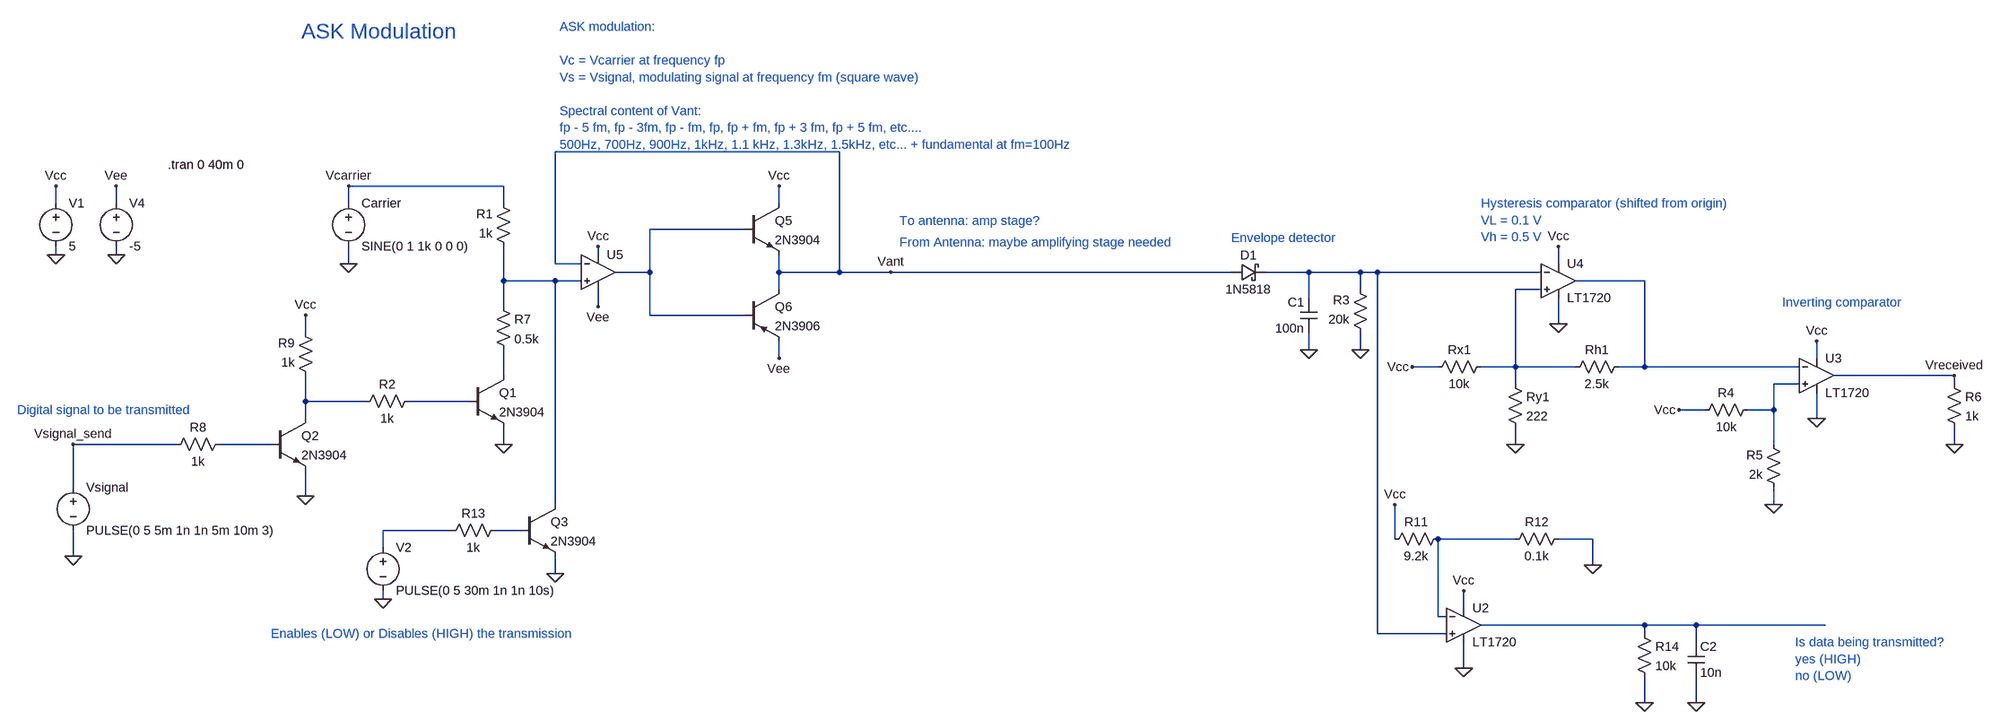
[diagram p0: schematic ASK-modulation3.asc]
ASK-modulation3.asc, the LTspice schematic file:
Version 4
SHEET 1 3624 1304
WIRE 400 -32 -128 -32
WIRE -224 32 -512 32
WIRE -1056 64 -1056 32
WIRE -944 64 -944 32
WIRE -512 64 -512 32
WIRE -224 64 -224 32
WIRE 288 64 288 32
WIRE 224 112 48 112
WIRE -1056 160 -1056 144
WIRE -944 160 -944 144
WIRE -48 160 -48 144
WIRE -512 176 -512 144
WIRE -128 176 -128 -32
WIRE -80 176 -128 176
WIRE 1760 176 1760 144
WIRE 48 192 48 112
WIRE 48 192 -16 192
WIRE 288 192 288 160
WIRE 400 192 400 -32
WIRE 400 192 288 192
WIRE 496 192 400 192
WIRE 1152 192 496 192
WIRE 1296 192 1216 192
WIRE 1392 192 1296 192
WIRE 1424 192 1392 192
WIRE 1728 192 1424 192
WIRE -224 208 -224 144
WIRE -128 208 -224 208
WIRE -80 208 -128 208
WIRE 1920 208 1792 208
WIRE 288 224 288 192
WIRE 1392 224 1392 192
WIRE 1728 224 1680 224
WIRE 1296 240 1296 192
WIRE -224 256 -224 208
WIRE -48 256 -48 224
WIRE 48 272 48 192
WIRE 224 272 48 272
WIRE 1760 288 1760 240
WIRE -592 304 -592 272
WIRE 1296 336 1296 304
WIRE 1392 336 1392 304
WIRE 288 352 288 320
WIRE 2240 352 2240 320
WIRE 1536 368 1488 368
WIRE 1680 368 1680 224
WIRE 1680 368 1616 368
WIRE 1792 368 1680 368
WIRE 1920 368 1920 208
WIRE 1920 368 1872 368
WIRE 2208 368 1920 368
WIRE -224 384 -224 336
WIRE 2496 384 2272 384
WIRE 1680 400 1680 368
WIRE 2208 400 2160 400
WIRE 2496 400 2496 384
WIRE -592 432 -592 384
WIRE -480 432 -592 432
WIRE -288 432 -400 432
WIRE 2032 448 1984 448
WIRE 2160 448 2160 400
WIRE 2160 448 2112 448
WIRE -592 464 -592 432
WIRE 2240 464 2240 416
WIRE -832 512 -1024 512
WIRE -656 512 -752 512
WIRE -224 512 -224 480
WIRE 1680 512 1680 480
WIRE 2160 512 2160 448
WIRE 2496 512 2496 480
WIRE -1024 592 -1024 512
WIRE -592 608 -592 560
WIRE -128 624 -128 208
WIRE 2160 624 2160 592
WIRE -320 672 -448 672
WIRE -192 672 -240 672
WIRE 1456 688 1456 624
WIRE 1680 688 1536 688
WIRE 1824 688 1760 688
WIRE -448 704 -448 672
WIRE -1024 720 -1024 672
WIRE 1824 736 1824 688
WIRE -128 752 -128 720
WIRE -448 800 -448 784
WIRE 1584 816 1584 784
WIRE 1536 832 1536 688
WIRE 1552 832 1536 832
WIRE 1920 848 1616 848
WIRE 2016 848 1920 848
WIRE 2256 848 2016 848
WIRE 1424 864 1424 192
WIRE 1552 864 1424 864
WIRE 1920 864 1920 848
WIRE 2016 880 2016 848
WIRE 1584 928 1584 880
WIRE 1920 992 1920 944
WIRE 2016 992 2016 944
FLAG -1024 720 0
FLAG -512 176 0
FLAG -224 512 0
FLAG -1056 160 0
FLAG -1056 32 Vcc
FLAG -944 160 0
FLAG -944 32 Vee
FLAG 1392 336 0
FLAG 1760 144 Vcc
FLAG 1680 512 0
FLAG 1760 288 0
FLAG 1488 368 Vcc
FLAG 2240 320 Vcc
FLAG 2240 464 0
FLAG 2160 624 0
FLAG 1984 448 Vcc
FLAG 2496 512 0
FLAG -48 144 Vcc
FLAG -48 256 Vee
FLAG 1296 336 0
FLAG 2496 384 Vreceived
FLAG 496 192 Vant
FLAG -592 272 Vcc
FLAG -592 608 0
FLAG -128 752 0
FLAG -1024 512 Vsignal_send
FLAG -512 32 Vcarrier
FLAG 288 352 Vee
FLAG 288 32 Vcc
FLAG -448 800 0
FLAG 1584 784 Vcc
FLAG 1584 928 0
FLAG 1456 624 Vcc
FLAG 1824 736 0
FLAG 1920 992 0
FLAG 2016 992 0
SYMBOL voltage -1056 48 R0
WINDOW 123 0 0 Left 0
WINDOW 39 0 0 Left 0
SYMATTR InstName V1
SYMATTR Value 5
SYMBOL voltage -512 48 R0
WINDOW 123 0 0 Left 0
WINDOW 39 0 0 Left 0
SYMATTR InstName Carrier
SYMATTR Value SINE(0 1 1k 0 0 0)
SYMBOL res -208 160 R180
WINDOW 0 36 76 Left 2
WINDOW 3 36 40 Left 2
SYMATTR InstName R1
SYMATTR Value 1k
SYMBOL npn -288 384 R0
SYMATTR InstName Q1
SYMATTR Value 2N3904
SYMBOL voltage -1024 576 R0
WINDOW 123 0 0 Left 0
WINDOW 39 0 0 Left 0
SYMATTR InstName Vsignal
SYMATTR Value PULSE(0 5 5m 1n 1n 5m 10m 3)
SYMBOL voltage -944 48 R0
WINDOW 123 0 0 Left 0
WINDOW 39 0 0 Left 0
SYMATTR InstName V4
SYMATTR Value -5
SYMBOL res -384 416 R90
WINDOW 0 0 56 VBottom 2
WINDOW 3 32 56 VTop 2
SYMATTR InstName R2
SYMATTR Value 1k
SYMBOL res 1408 320 R180
WINDOW 0 36 76 Left 2
WINDOW 3 36 40 Left 2
SYMATTR InstName R3
SYMATTR Value 20k
SYMBOL cap 1312 304 R180
WINDOW 0 24 56 Left 2
WINDOW 3 24 8 Left 2
SYMATTR InstName C1
SYMATTR Value 100n
SYMBOL res 1632 352 R90
WINDOW 0 0 56 VBottom 2
WINDOW 3 32 56 VTop 2
SYMATTR InstName Rx1
SYMATTR Value 10k
SYMBOL res 1664 384 R0
SYMATTR InstName Ry1
SYMATTR Value 222
SYMBOL res 1888 352 R90
WINDOW 0 0 56 VBottom 2
WINDOW 3 32 56 VTop 2
SYMATTR InstName Rh1
SYMATTR Value 2.5k
SYMBOL Comparators\\LT1720 1760 144 R0
SYMATTR InstName U4
SYMBOL Comparators\\LT1720 2240 320 R0
SYMATTR InstName U3
SYMBOL res 2128 432 R90
WINDOW 0 0 56 VBottom 2
WINDOW 3 32 56 VTop 2
SYMATTR InstName R4
SYMATTR Value 10k
SYMBOL res 2176 608 R180
WINDOW 0 36 76 Left 2
WINDOW 3 36 40 Left 2
SYMATTR InstName R5
SYMATTR Value 2k
SYMBOL res 2480 384 R0
SYMATTR InstName R6
SYMATTR Value 1k
SYMBOL Opamps\\UniversalOpamp2 -48 192 R0
SYMATTR InstName U5
SYMBOL schottky 1152 208 R270
WINDOW 0 32 32 VTop 2
WINDOW 3 0 32 VBottom 2
SYMATTR InstName D1
SYMATTR Value 1N5818
SYMATTR Description Diode
SYMATTR Type diode
SYMBOL res -240 240 R0
SYMATTR InstName R7
SYMATTR Value 0.5k
SYMBOL npn -656 464 R0
SYMATTR InstName Q2
SYMATTR Value 2N3904
SYMBOL res -736 496 R90
WINDOW 0 0 56 VBottom 2
WINDOW 3 32 56 VTop 2
SYMATTR InstName R8
SYMATTR Value 1k
SYMBOL res -576 400 R180
WINDOW 0 36 76 Left 2
WINDOW 3 36 40 Left 2
SYMATTR InstName R9
SYMATTR Value 1k
SYMBOL npn -192 624 R0
SYMATTR InstName Q3
SYMATTR Value 2N3904
SYMBOL res -224 656 R90
WINDOW 0 0 56 VBottom 2
WINDOW 3 32 56 VTop 2
SYMATTR InstName R13
SYMATTR Value 1k
SYMBOL npn 224 64 R0
SYMATTR InstName Q5
SYMATTR Value 2N3904
SYMBOL pnp 224 224 R0
SYMATTR InstName Q6
SYMATTR Value 2N3906
SYMBOL voltage -448 688 R0
WINDOW 123 0 0 Left 0
WINDOW 39 0 0 Left 0
SYMATTR InstName V2
SYMATTR Value PULSE(0 5 30m 1n 1n 10s)
SYMBOL Comparators\\LT1720 1584 784 R0
SYMATTR InstName U2
SYMBOL res 1552 672 R90
WINDOW 0 0 56 VBottom 2
WINDOW 3 32 56 VTop 2
SYMATTR InstName R11
SYMATTR Value 9.2k
SYMBOL res 1776 672 R90
WINDOW 0 0 56 VBottom 2
WINDOW 3 32 56 VTop 2
SYMATTR InstName R12
SYMATTR Value 0.1k
SYMBOL res 1904 848 R0
SYMATTR InstName R14
SYMATTR Value 10k
SYMBOL cap 2000 880 R0
SYMATTR InstName C2
SYMATTR Value 10n
TEXT -600 -256 Left 4 ;ASK Modulation
TEXT -848 -8 Left 2 !.tran 0 40m 0
TEXT 512 96 Left 2 ;To antenna: amp stage?
TEXT -1128 448 Left 2 ;Digital signal to be transmitted
TEXT 512 136 Left 2 ;From Antenna: maybe amplifying stage needed
TEXT 1152 128 Left 2 ;Envelope detector
TEXT 1616 64 Left 2 ;Hysteresis comparator (shifted from origin)\nVL = 0.1 V\nVh = 0.5 V
TEXT 2176 248 Left 2 ;Inverting comparator
TEXT -120 -264 Left 2 ;ASK modulation:\n \nVc = Vcarrier at frequency fp\nVs = Vsignal, modulating signal at frequency fm (square wave)\n \nSpectral content of Vant:\nfp - 5 fm, fp - 3fm, fp - fm, fp, fp + fm, fp + 3 fm, fp + 5 fm, etc....\n500Hz, 700Hz, 900Hz, 1kHz, 1.1 kHz, 1.3kHz, 1.5kHz, etc... + fundamental at fm=100Hz
TEXT -656 864 Left 2 ;Enables (LOW) or Disables (HIGH) the transmission
TEXT 2200 880 Left 2 ;Is data being transmitted?\nyes (HIGH)\nno (LOW)

The netlist it stands for:
* ASK-modulation3.asc
V1 Vcc 0 5
V§Carrier Vcarrier 0 SINE(0 1 1k 0 0 0)
R1 N003 Vcarrier 1k
Q1 N006 N009 0 0 2N3904
Vsignal Vsignal_send 0 PULSE(0 5 5m 1n 1n 5m 10m 3)
V4 Vee 0 -5
R2 N009 N008 1k
R3 0 N002 20k
C1 0 N002 100n
Rx1 N005 Vcc 10k
Ry1 N005 0 222
Rh1 N004 N005 2.5k
XU4 N005 N002 Vcc 0 N004 LT1720  ; pins In+ In- V+ V- OUT
XU3 N007 N004 Vcc 0 Vreceived LT1720  ; pins In+ In- V+ V- OUT
R4 N007 Vcc 10k
R5 0 N007 2k
R6 Vreceived 0 1k
XU5 N003 Vant Vcc Vee N001 level.2 Avol=1Meg GBW=10Meg Slew=10Meg ilimit=25m rail=0 Vos=0 phimargin=45 en=0 enk=0 in=0 ink=0 Rin=500Meg  ; pins IN+ IN- V+ V- OUT
D1 Vant N002 1N5818
R7 N003 N006 0.5k
Q2 N008 N010 0 0 2N3904
R8 N010 Vsignal_send 1k
R9 N008 Vcc 1k
Q3 N003 N012 0 0 2N3904
R13 N012 N011 1k
Q5 Vcc N001 Vant 0 2N3904
Q6 Vant N001 Vee 0 2N3906
V2 N011 0 PULSE(0 5 30m 1n 1n 10s)
XU2 N002 N013 Vcc 0 N014 LT1720  ; pins In+ In- V+ V- OUT
R11 N013 Vcc 9.2k
R12 0 N013 0.1k
R14 N014 0 10k
C2 N014 0 10n
.model D D
.lib standard.dio
.model NPN NPN
.model PNP PNP
.lib standard.bjt
* ASK Modulation
.tran 0 40m 0
* To antenna: amp stage?
* Digital signal to be transmitted
* From Antenna: maybe amplifying stage needed
* Envelope detector
* Hysteresis comparator (shifted from origin)
* VL = 0.1 V
* Vh = 0.5 V
* Inverting comparator
* ASK modulation:
* Vc = Vcarrier at frequency fp
* Vs = Vsignal, modulating signal at frequency fm (square wave)
* Spectral content of Vant:
* fp - 5 fm, fp - 3fm, fp - fm, fp, fp + fm, fp + 3 fm, fp + 5 fm, etc....
* 500Hz, 700Hz, 900Hz, 1kHz, 1.1 kHz, 1.3kHz, 1.5kHz, etc... + fundamental at fm=100Hz
* Enables (LOW) or Disables (HIGH) the transmission
* Is data being transmitted?
* yes (HIGH)
* no (LOW)
.lib LT1720.sub
.lib UniversalOpamps2.sub
.backanno
.end